# Altium schematic sheet p6_wch_link.SchDoc
size A3; Organization: ORGANIZATION; Address1: ADDRESS 1; Address2: ADDRESS 2; Address3: ADDRESS 3; Address4: ADDRESS 4; Revision: Rev. A; ENG_APP_DATE: --/--/--; DSN_APP_DATE: --/--/--; CHK_APP_DATE: --/--/--
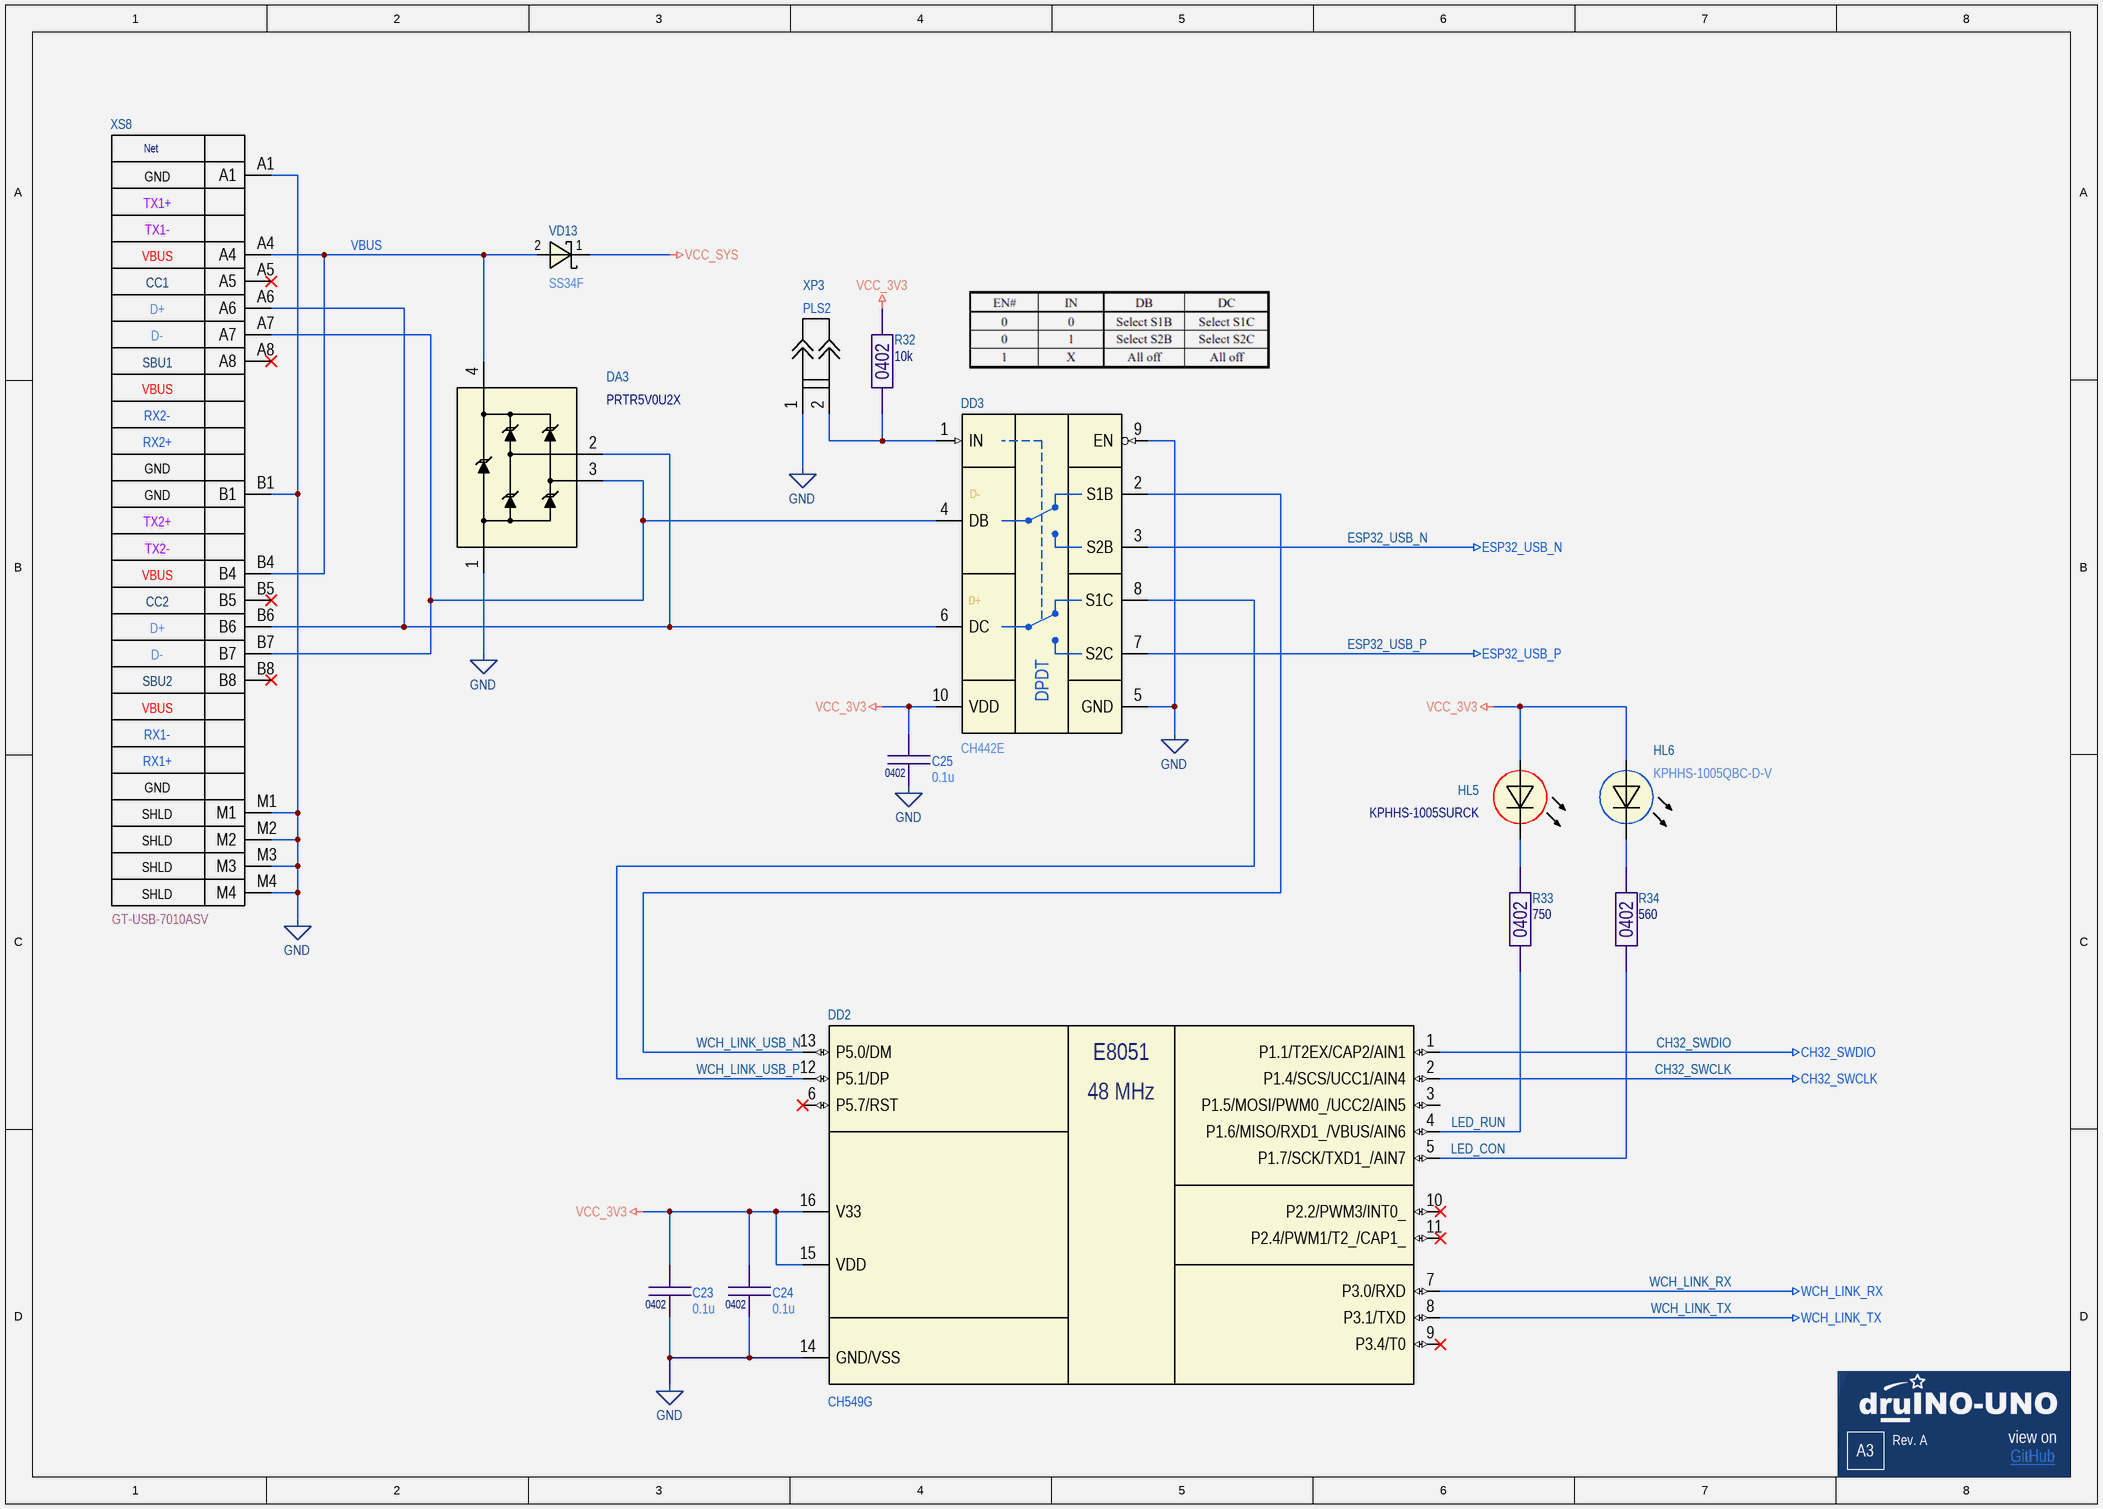
[diagram p0: p6_wch_link.SchDoc]

## Parts
C23  0.1u  Package: 0402  [CAP0402]
C24  0.1u  Package: 0402  [CAP0402]
C25  0.1u  Package: 0402  [CAP0402]
DA3  PRTR5V0U2X  [SOT143]
DD2  CH549G  [SOIC-16]
DD3  CH442E  [MSOP-10]
HL5  KPHHS-1005SURCK  [LED0402R]
HL6  KPHHS-1005QBC-D-V  [LED0402B]
R32  10k  Package: 0402  [RES0402B]
R33  750  Package: 0402  [RES0402B]
R34  560  Package: 0402  [RES0402B]
VD13  SS34F  [SMA-FL]
XP3  PLS2  [PLS-2]
XS8  GT-USB-7010ASV  [GT-USB-7010ASV]

## Nets
CH32_SWCLK: DD2.2(P1.4/SCS/UCC1/AIN4)
CH32_SWDIO: DD2.1(P1.1/T2EX/CAP2/AIN1)
ESP32_USB_N: DD3.3(S2B)
ESP32_USB_P: DD3.7(S2C)
GND: C23.2 C24.2 C25.2 DA3.1(GND) DD2.14(GND/VSS) DD3.5(GND) DD3.9(EN) XP3.1 XS8.A1 XS8.B1 XS8.M1 XS8.M2 XS8.M3 XS8.M4
VCC_3V3: C23.1 C24.1 C25.1 DD2.15(VDD) DD2.16(V33) DD3.10(VDD) HL5.2 HL6.2 R32.1
VCC_SYS: VD13.1
WCH_LINK_RX: DD2.7(P3.0/RXD)
WCH_LINK_TX: DD2.8(P3.1/TXD)
LED_CON: DD2.5(P1.7/SCK/TXD1_/AIN7) R34.2
LED_RUN: DD2.4(P1.6/MISO/RXD1_/VBUS/AIN6) R33.2
VBUS: DA3.4(VCC) VD13.2 XS8.A4 XS8.B4
WCH_LINK_USB_N: DD2.13(P5.0/DM) DD3.2(S1B)
WCH_LINK_USB_P: DD2.12(P5.1/DP) DD3.8(S1C)
NetDA3_2: DA3.2(IO1) DD3.6(DC) XS8.A6 XS8.B6
NetDA3_3: DA3.3(IO2) DD3.4(DB) XS8.A7 XS8.B7
NetDD3_1: DD3.1(IN) R32.2 XP3.2
NetHL5_1: HL5.1 R33.1
NetHL6_1: HL6.1 R34.1

Not connected (* = marked no-connect by the designer): DD2 3(P1.5/MOSI/PWM0_/UCC2/AIN5) 6(P5.7/RST)* 9(P3.4/T0)* 10(P2.2/PWM3/INT0_)* 11(P2.4/PWM1/T2_/CAP1_)*; XS8 A5* A8* B5* B8*

## Notes on the sheet
- (near DD3) D-
- (near DD3) D+
- A3
- GitHub <https://github.com/kirra-cat/druino-uno>
- view on
- (in symbol CH442E) DPDT
- (in symbol CH549G) E8051; 48 MHz
- (in symbol GT-USB-7010ASV) Net; GND; TX1+; TX1-; VBUS; CC1; D+; D-; SBU1; RX2-; RX2+; TX2+; TX2-; CC2; SBU2; RX1-; RX1+; SHLD

## Library data of the parts
C23-C25 = C0402: Capacitors 0402 package case; Part Number: TCC0402X7R104J500AT; Manufacturer: CCTC; Tolerance: ± 5 %; Dielectric: X7R; Voltage: 50 V; Value: 0.1u; Value on schem: 0.1u
DA3 = PRTR5V0U2X: Ultra low capacitance double rail-to-rail ESD protection diode; Manufacturer: NXP USA Inc.; Part Number: PRTR5V0U2X; Package: SOT-143
DD2 = CH549G: 8-bit Enhanced USB MCU; Manufacturer: WinChipHead; Package: SOP16; Part Number: CH549G
DD3 = CH442E: Double-pole Double-throw Low-Resistance Analog Switch IC; Manufacturer: WinChipHead; Package: MSOP-10; Part Number: CH442E
HL5 = KPHHS-1005SURCK: Red led (package case 0402); Manufacturer: Kingbright Company LLC.; Designator: HL*; Forward Current: 20 mA; Forward Voltage: 1.95V; Wavelength: 630 nm; Package: 0402; Part Number: KPHHS-1005SURCK; Color: Red
HL6 = KPHHS-1005QBC-D-V: Blue led (package case 0402); Manufacturer: Kingbright Company LLC.; Designator: HL*; Forward Current: 20 mA; Forward Voltage: 3.3V; Wavelength: 465 nm; Package: 0402; Part Number: KPHHS-1005QBC-D-V; Color: Blue
R32 = R0402: Resistor 0402 package case; Part Number: RC0402FR-0710KL; Manufacturer: Yageo; Tolerance: ± 1 %; Temperature Coefficient: ±100 ppm/K; Value: 10k; Value on schem: 10k
R33 = R0402: Resistor 0402 package case; Part Number: RC0402FR-07750RL; Manufacturer: Yageo; Tolerance: ± 1 %; Temperature Coefficient: ±100 ppm/K; Value: 750; Value on schem: 750
R34 = R0402: Resistor 0402 package case; Part Number: RC0402FR-07560RL; Manufacturer: Yageo; Tolerance: ± 1 %; Temperature Coefficient: ±100 ppm/K; Value: 560; Value on schem: 560
VD13 = SS34F: 3A Schottky barrier rectifier; Manufacturer: UMW; Package: SMAF; Part Number: SS34F
XS8 = GT-USB-7010ASV: USB 2.0 Female 3A Surface 16P; Manufacturer: G-Switch; Part Number: GT-USB-7010ASV
XP3 = PLS2: Value: PLS2